# Altium schematic sheet ADC_Interface.SchDoc: ADC and DAC Signal Conditioning
size Tabloid; Organization: Davis Designs; Address1: Flycatcher Labs; SheetNumber: 5; SheetTotal: 6
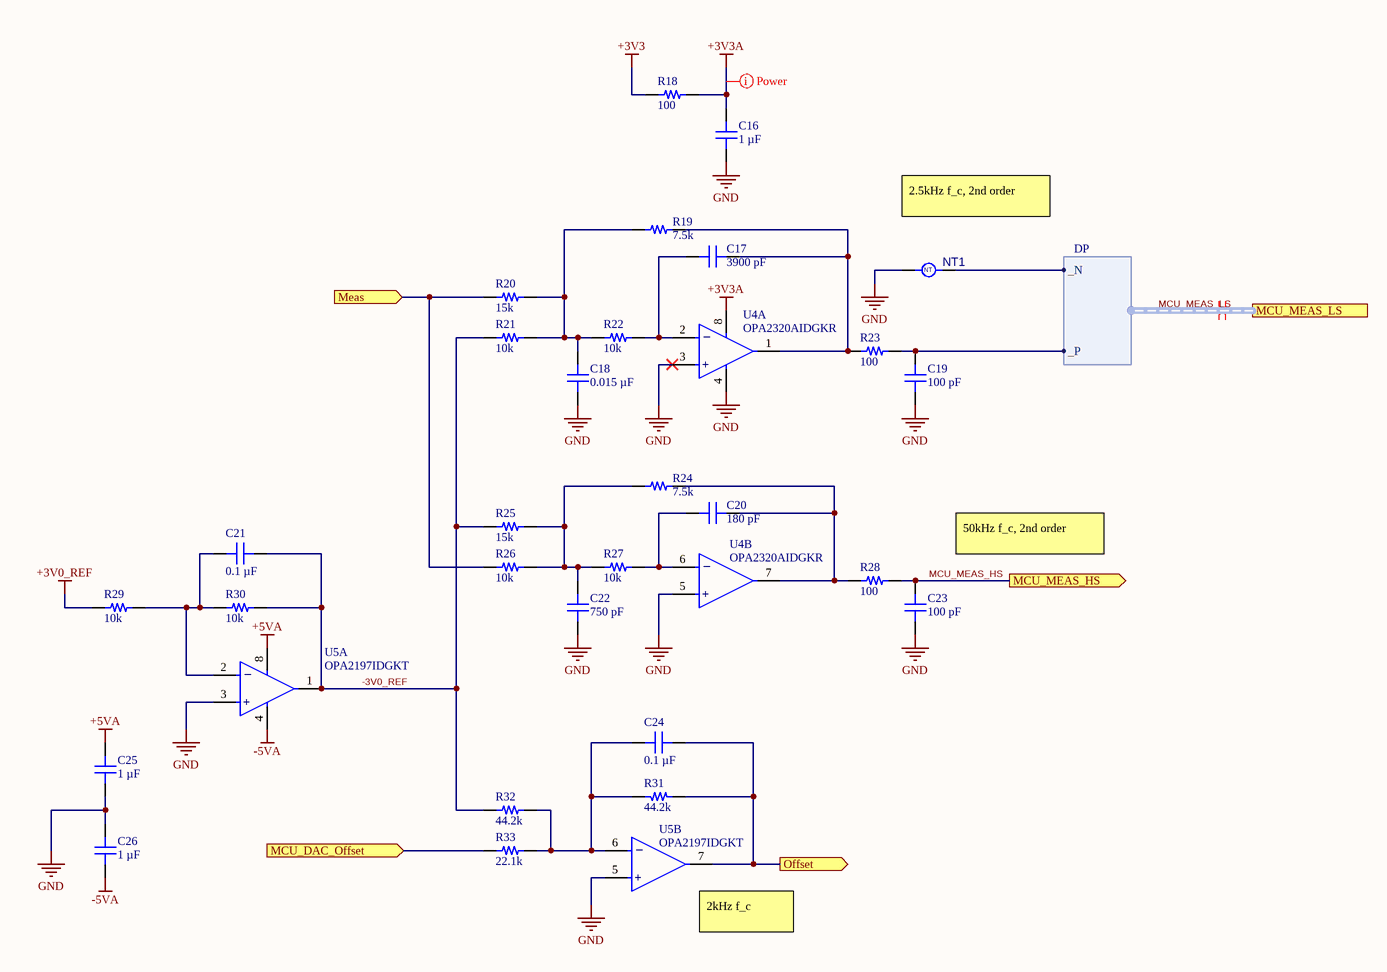
[diagram p0: ADC_Interface.SchDoc]

## Parts
C16  1 µF  [MURATA GRM155 0402_1005]
C17  3900 pF  [MURATA GRM155 0402_1005]
C18  0.015 µF  [MURATA GCM155 0402_1005]
C19  100 pF  [MURATA GCM155 0402_1005]
C20  180 pF  [MURATA GCM155 0402_1005]
C21  0.1 µF  [MURATA GRM155 0402_1005]
C22  750 pF  [MURATA GCM155 0402_1005]
C23  100 pF  [MURATA GCM155 0402_1005]
C24  0.1 µF  [MURATA GRM155 0402_1005]
C25  1 µF  [MURATA GRM155 0402_1005]
C26  1 µF  [MURATA GRM155 0402_1005]
NT1  Net Tie 10x8mil  [New footprint 1]  (value not drawn)  (net tie, no BOM)
R18  100  [RES 0402_1005]
R19  7.5k  [RES 0402_1005]
R20  15k  [RES 0402_1005]
R21  10k  [RES 0402_1005]
R22  10k  [RES 0402_1005]
R23  100  [RES 0402_1005]
R24  7.5k  [RES 0402_1005]
R25  15k  [RES 0402_1005]
R26  10k  [RES 0402_1005]
R27  10k  [RES 0402_1005]
R28  100  [RES 0402_1005]
R29  10k  [RES 0402_1005]
R30  10k  [RES 0402_1005]
R31  44.2k  [RES 0402_1005]
R32  44.2k  [RES 0402_1005]
R33  22.1k  [RES 0402_1005]
U4  OPA2320AIDGKR  [FP-DGK0008A-MFG]  (parts A,B of 2)
U5  OPA2197IDGKT  [FP-DGK0008A-MFG]  (parts A,B of 2)

## Ports
MCU_DAC_Offset (in), MCU_MEAS_HS (out), MCU_MEAS_LS (harness DP), Meas (in), Offset (out)

## Harnesses
DP: _N, _P

## Nets
+3V0_REF: R29.2
+3V3: R18.1
+3V3A: C16.2 R18.2 U4.8(V+)
+5VA: C25.2 U5.8(V+)
-5VA: C26.1 U5.4(V-)
GND: C16.1 C18.1 C19.1 C22.1 C23.1 C25.1 C26.2 NT1.1 U4.3(+INA) U4.4(V-) U4.5(+INB) U5.3(+INA) U5.5(+INB)
-3V0_REF: C21.1 R21.2 R25.1 R30.1 R32.1 U5.1(OUTA)
MCU_DAC_Offset: R33.1 ; port MCU_DAC_Offset
MCU_MEAS_HS: C23.2 R28.2 ; port MCU_MEAS_HS
MCU_MEAS_LS._N: NT1.2 ; port MCU_MEAS_LS._N
MCU_MEAS_LS._P: C19.2 R23.2 ; port MCU_MEAS_LS._P
Meas: R20.1 R26.2 ; port Meas
Offset: C24.1 R31.2 U5.7(OUTB) ; port Offset
NetC17_1: C17.1 R22.1 U4.2(-INA)
NetC17_2: C17.2 R19.2 R23.1 U4.1(OUTA)
NetC18_2: C18.2 R19.1 R20.2 R21.1 R22.2
NetC20_1: C20.1 R27.1 U4.6(-INB)
NetC20_2: C20.2 R24.2 R28.1 U4.7(OUTB)
NetC21_2: C21.2 R29.1 R30.2 U5.2(-INA)
NetC22_2: C22.2 R24.1 R25.2 R26.1 R27.2
NetC24_2: C24.2 R31.1 R32.2 R33.2 U5.6(-INB)

## Buses and harness runs
harness MCU_MEAS_LS = port MCU_MEAS_LS

## Layout directives
differential pair: (no net found under the mark)
net class Power: +3V3A

## Notes on the sheet
- 2.5kHz f_c, 2nd order
- 50kHz f_c, 2nd order
- (near U5) 2kHz f_c
- (in symbol CMP-009-00116-4) NT
- (in symbol CMP-014-00003-2, part A) –; +
- (in symbol CMP-014-00003-2, part B) –; +
- (in symbol CMP-014-00010-1, part A) –; +
- (in symbol CMP-014-00010-1, part B) –; +

## Library data of the parts
C16 C25 C26 = GRM155R61E105MA12D: CAP CER 1UF 25V X5R 0402; manufacturer: Murata Electronics; Tolerance: ±20%; Part Number: GRM155R61E105MA12D; Value: 1 µF; Applications: General Purpose; Capacitance: 1 µF; componentlink1description: Datasheet; componentlink1url: https://search.murata.co.jp/Ceramy/image/img/A01X/G101/ENG/GRM155R61E105MA12-01.pdf; componentlink2description: DigiKey Link; componentlink2url: https://www.digikey.com/en/products/detail/murata-electronics/GRM155R61E105MA12D/4905141; Device Package: 0402 (1005 Metric); lastupdated: 7/25/2024 4:50:24 AM; Lifecycle Status: Active; Minimum Order: 1; Mounting Type: Surface Mount, MLCC; Operating Temperature: -55°C ~ 85°C; Package / Case: 0402 (1005 Metric); packaging: TapeAndReel; partid: 3014; Part Status: Active; price: 0.01; series: GRM; Size / Dimension: 0.039" L x 0.020" W (1.00mm x 0.50mm); Supplier 1: DigiKey; Supplier Part Number 1: 490-10018-1-ND; Temperature Coefficient: X5R; Thickness (Max): 0.022" (0.55mm); Voltage - Rated: 25V
C17 = GRM1555C1H392GE01D: CAP CER 3900PF 50V C0G/NP0 0402; manufacturer: Murata Electronics; Temperature Coefficient: C0G, NP0; Tolerance: ±2%; Part Number: GRM1555C1H392GE01D; Value: 3900 pF; Applications: General Purpose; Capacitance: 3900 pF; componentlink1description: Datasheet; componentlink1url: https://search.murata.co.jp/Ceramy/image/img/A01X/G101/ENG/GRM1555C1H392GE01-01A.pdf; componentlink2description: DigiKey Link; componentlink2url: https://www.digikey.com/en/products/detail/murata-electronics/GRM1555C1H392GE01D/16033593; Device Package: 0402 (1005 Metric); lastupdated: 7/25/2024 4:50:21 AM; Lifecycle Status: Active; Minimum Order: 1; Mounting Type: Surface Mount, MLCC; Operating Temperature: -55°C ~ 125°C; Package / Case: 0402 (1005 Metric); packaging: TapeAndReel; partid: 41082; Part Status: Active; price: 0.01; series: GRM; Size / Dimension: 0.039" L x 0.020" W (1.00mm x 0.50mm); Supplier 1: DigiKey; Supplier Part Number 1: 490-GRM1555C1H392GE01DCT-ND; Thickness (Max): 0.022" (0.55mm); Voltage - Rated: 50V
C18 = GCM155R71H153KA55J: CAP CER 0.015UF 50V X7R 0402; manufacturer: Murata Electronics; Tolerance: ±10%; Part Number: GCM155R71H153KA55J; Value: 0.015 µF; Applications: Automotive; Capacitance: 0.015 µF; componentlink1description: Datasheet; componentlink1url: https://www.murata.com/-/media/webrenewal/support/library/catalog/products/k35e.ashx?la=en-us&cvid=20200508021757000000; componentlink2description: DigiKey Link; componentlink2url: https://www.digikey.com/en/products/detail/murata-electronics/GCM155R71H153KA55J/2591306; Device Package: 0402 (1005 Metric); lastupdated: 7/20/2024 2:04:16 AM; Lifecycle Status: Active; Minimum Order: 1; Mounting Type: Surface Mount, MLCC; Operating Temperature: -55°C ~ 125°C; Package / Case: 0402 (1005 Metric); packaging: TapeAndReel; partid: 49951; Part Status: Active; price: 0.01; Ratings: AEC-Q200; series: GCM; Size / Dimension: 0.039" L x 0.020" W (1.00mm x 0.50mm); Supplier 1: DigiKey; Supplier Part Number 1: 490-GCM155R71H153KA55JCT-ND; Temperature Coefficient: X7R; Thickness (Max): 0.022" (0.55mm); Voltage - Rated: 50V
C19 C23 = GCM1555C1H101FA16D: CAP CER 100PF 50V C0G/NP0 0402; manufacturer: Murata Electronics; Temperature Coefficient: C0G, NP0; Tolerance: ±1%; Part Number: GCM1555C1H101FA16D; Value: 100 pF; Applications: Automotive; Capacitance: 100 pF; componentlink1description: Datasheet; componentlink1url: https://search.murata.co.jp/Ceramy/image/img/A01X/G101/ENG/GCM1555C1H101FA16-01.pdf; componentlink2description: DigiKey Link; componentlink2url: https://www.digikey.com/en/products/detail/murata-electronics/GCM1555C1H101FA16D/6605978; Device Package: 0402 (1005 Metric); lastupdated: 7/20/2024 2:04:18 AM; Lifecycle Status: Active; Minimum Order: 1; Mounting Type: Surface Mount, MLCC; Operating Temperature: -55°C ~ 125°C; Package / Case: 0402 (1005 Metric); packaging: TapeAndReel; partid: 7484; Part Status: Active; price: 0.01; Ratings: AEC-Q200; series: GCM; Size / Dimension: 0.039" L x 0.020" W (1.00mm x 0.50mm); Supplier 1: DigiKey; Supplier Part Number 1: 490-14349-1-ND; Thickness (Max): 0.022" (0.55mm); Voltage - Rated: 50V
C20 = GCM1555C1H181JA16J: CAP CER 180PF 50V C0G/NP0 0402; manufacturer: Murata Electronics; Temperature Coefficient: C0G, NP0; Tolerance: ±5%; Part Number: GCM1555C1H181JA16J; Value: 180 pF; Applications: Automotive; Capacitance: 180 pF; componentlink1description: Datasheet; componentlink1url: https://www.murata.com/-/media/webrenewal/support/library/catalog/products/k35e.ashx?la=en-us&cvid=20200508021757000000; componentlink2description: DigiKey Link; componentlink2url: https://www.digikey.com/en/products/detail/murata-electronics/GCM1555C1H181JA16J/2590984; Device Package: 0402 (1005 Metric); lastupdated: 7/20/2024 2:04:15 AM; Lifecycle Status: Active; Minimum Order: 1; Mounting Type: Surface Mount, MLCC; Operating Temperature: -55°C ~ 125°C; Package / Case: 0402 (1005 Metric); packaging: TapeAndReel; partid: 55031; Part Status: Active; price: 0.01; Ratings: AEC-Q200; series: GCM; Size / Dimension: 0.039" L x 0.020" W (1.00mm x 0.50mm); Supplier 1: DigiKey; Supplier Part Number 1: 490-GCM1555C1H181JA16JCT-ND; Thickness (Max): 0.022" (0.55mm); Voltage - Rated: 50V
C21 C24 = GRM155R61H104KE19D: CAP CER 0.1UF 50V X5R 0402; manufacturer: Murata Electronics; Tolerance: ±10%; Part Number: GRM155R61H104KE19D; Value: 0.1 µF; Applications: General Purpose; Capacitance: 0.1 µF; componentlink1description: Datasheet; componentlink1url: https://search.murata.co.jp/Ceramy/image/img/A01X/G101/ENG/GRM155R61H104KE19-01.pdf; componentlink2description: DigiKey Link; componentlink2url: https://www.digikey.com/en/products/detail/murata-electronics/GRM155R61H104KE19D/5360887; Device Package: 0402 (1005 Metric); lastupdated: 7/25/2024 4:50:24 AM; Lifecycle Status: Active; Minimum Order: 1; Mounting Type: Surface Mount, MLCC; Operating Temperature: -55°C ~ 85°C; Package / Case: 0402 (1005 Metric); packaging: TapeAndReel; partid: 2975; Part Status: Active; price: 0.01; series: GRM; Size / Dimension: 0.039" L x 0.020" W (1.00mm x 0.50mm); Supplier 1: DigiKey; Supplier Part Number 1: 490-11917-1-ND; Temperature Coefficient: X5R; Thickness (Max): 0.022" (0.55mm); Voltage - Rated: 50V
C22 = GCM1555C1H751GA16D: CAP CER 750PF 50V C0G/NP0 0402; manufacturer: Murata Electronics; Temperature Coefficient: C0G, NP0; Tolerance: ±2%; Part Number: GCM1555C1H751GA16D; Value: 750 pF; Applications: Automotive; Capacitance: 750 pF; componentlink1description: Datasheet; componentlink1url: https://search.murata.co.jp/Ceramy/image/img/A01X/G101/ENG/GCM1555C1H751GA16-01.pdf; componentlink2description: DigiKey Link; componentlink2url: https://www.digikey.com/en/products/detail/murata-electronics/GCM1555C1H751GA16D/16033401; Device Package: 0402 (1005 Metric); lastupdated: 7/20/2024 2:04:15 AM; Lifecycle Status: Active; Minimum Order: 1; Mounting Type: Surface Mount, MLCC; Operating Temperature: -55°C ~ 125°C; Package / Case: 0402 (1005 Metric); packaging: TapeAndReel; partid: 55175; Part Status: Active; price: 0.01; Ratings: AEC-Q200; series: GCM; Size / Dimension: 0.039" L x 0.020" W (1.00mm x 0.50mm); Supplier 1: DigiKey; Supplier Part Number 1: 490-GCM1555C1H751GA16DCT-ND; Thickness (Max): 0.022" (0.55mm); Voltage - Rated: 50V
NT1 = CMP-009-00116-4: Pins: 2; Max Operating Temperature: 155°C; Min Operating Temperature: -55°C; ClassName: NetTie
R18 R23 R28 = CRCW0402100RFKEE: RES SMD 100 OHM 1% 1/16W 0402; Manufacturer: Vishay Dale; Value: 100 Ohms; Power (Watts): 0.063W, 1/16W; Temperature Coefficient: ±100ppm/°C; Part Number: CRCW0402100RFKEE; ComponentLink1Description: Datasheet; ComponentLink1URL: http://www.vishay.com/docs/20035/dcrcwe3.pdf; ComponentLink2Description: DigiKey Link; ComponentLink2URL: https://www.digikey.com/en/products/detail/vishay-dale/CRCW0402100RFKEE/5069886; Composition: Thick Film; Device Package: 0402 (1005 Metric); Features: Automotive AEC-Q200; Height - Seated (Max): 0.016" (0.40mm); LastUpdated: 2/9/2024 8:30:05 PM; Lifecycle Status: Active; Minimum Order: 1; Number of Terminations: 2; Operating Temperature: -55°C ~ 155°C; Package / Case: 0402 (1005 Metric); Packaging: CutTape; PartId: 6830; Part Status: Active; Price: 0.01; Ratings: AEC-Q200; Resistance: 100 Ohms; Series: CRCW; Size / Dimension: 0.039" L x 0.020" W (1.00mm x 0.50mm); Supplier 1: DigiKey; Supplier Part Number 1: 541-2953-1-ND; Supplier Device Package: 0402; Tolerance: ±1%
R19 R24 = ERA-2ARB752X: RES SMD 7.5K OHM 0.1% 1/16W 0402; Manufacturer: Panasonic Electronic Components; Value: 7.5 kOhms; Power (Watts): 0.063W, 1/16W; Temperature Coefficient: ±10ppm/°C; Part Number: ERA-2ARB752X; ComponentLink1Description: Datasheet; ComponentLink1URL: https://industrial.panasonic.com/cdbs/www-data/pdf/RDM0000/AOA0000C307.pdf; ComponentLink2Description: DigiKey Link; ComponentLink2URL: https://www.digikey.com/en/products/detail/panasonic-electronic-components/ERA-2ARB752X/5140927; Composition: Thin Film; Device Package: 0402 (1005 Metric); Features: Automotive AEC-Q200; Height - Seated (Max): 0.016" (0.40mm); LastUpdated: 2/9/2024 8:29:59 PM; Lifecycle Status: Active; Minimum Order: 1; Number of Terminations: 2; Operating Temperature: -55°C ~ 155°C; Package / Case: 0402 (1005 Metric); Packaging: TapeAndReel; PartId: 9056; Part Status: Active; Price: 0.21; Ratings: AEC-Q200; Resistance: 7.5 kOhms; Series: ERA-2A; Size / Dimension: 0.039" L x 0.020" W (1.00mm x 0.50mm); Supplier 1: DigiKey; Supplier Part Number 1: P7.5KCPCT-ND; Supplier Device Package: 0402; Tolerance: ±0.1%
R20 R25 = ERA-2AEB153X: RES SMD 15K OHM 0.1% 1/16W 0402; Manufacturer: Panasonic Electronic Components; Value: 15 kOhms; Power (Watts): 0.063W, 1/16W; Temperature Coefficient: ±25ppm/°C; Part Number: ERA-2AEB153X; ComponentLink1Description: Datasheet; ComponentLink1URL: https://industrial.panasonic.com/cdbs/www-data/pdf/RDM0000/AOA0000C307.pdf; ComponentLink2Description: DigiKey Link; ComponentLink2URL: https://www.digikey.com/en/products/detail/panasonic-electronic-components/ERA-2AEB153X/1706033; Composition: Thin Film; Device Package: 0402 (1005 Metric); Features: Automotive AEC-Q200; Height - Seated (Max): 0.016" (0.40mm); LastUpdated: 2/9/2024 8:30:08 PM; Lifecycle Status: Active; Minimum Order: 1; Number of Terminations: 2; Operating Temperature: -55°C ~ 155°C; Package / Case: 0402 (1005 Metric); Packaging: TapeAndReel; PartId: 6168; Part Status: Active; Price: 0.04; Ratings: AEC-Q200; Resistance: 15 kOhms; Series: ERA-2A; Size / Dimension: 0.039" L x 0.020" W (1.00mm x 0.50mm); Supplier 1: DigiKey; Supplier Part Number 1: P15KDCCT-ND; Supplier Device Package: 0402; Tolerance: ±0.1%
R21 R22 R26 R27 R29 R30 = ERA-2VRW1002X: RES 10K OHM 0.05% 1/10W 0402; Manufacturer: Panasonic Electronic Components; Value: 10 kOhms; Power (Watts): 0.1W, 1/10W; Temperature Coefficient: ±10ppm/°C; Part Number: ERA-2VRW1002X; ComponentLink1Description: Datasheet; ComponentLink1URL: https://api.pim.na.industrial.panasonic.com/file_stream/main/fileversion/9152; ComponentLink2Description: DigiKey Link; ComponentLink2URL: https://www.digikey.com/en/products/detail/panasonic-electronic-components/ERA-2VRW1002X/12085128; Composition: Thin Film; Device Package: 0402 (1005 Metric); Height - Seated (Max): 0.016" (0.40mm); LastUpdated: 2/9/2024 8:28:44 PM; Lifecycle Status: Active; Minimum Order: 1; Number of Terminations: 2; Operating Temperature: -55°C ~ 155°C; Package / Case: 0402 (1005 Metric); Packaging: TapeAndReel; PartId: 70282; Part Status: Active; Price: 0.21; Resistance: 10 kOhms; Series: ERA-2V; Size / Dimension: 0.039" L x 0.020" W (1.00mm x 0.50mm); Supplier 1: DigiKey; Supplier Part Number 1: 10-ERA-2VRW1002XCT-ND; Supplier Device Package: 0402; Tolerance: ±0.05%; Features: Anti-Sulfur, Automotive AEC-Q200; Ratings: AEC-Q200
R31 R32 = ERA-2ARB4422X: RES SMD 44.2KOHM 0.1% 1/16W 0402; Manufacturer: Panasonic Electronic Components; Value: 44.2 kOhms; Power (Watts): 0.063W, 1/16W; Temperature Coefficient: ±10ppm/°C; Part Number: ERA-2ARB4422X; ComponentLink1Description: Datasheet; ComponentLink1URL: https://industrial.panasonic.com/cdbs/www-data/pdf/RDM0000/AOA0000C307.pdf; ComponentLink2Description: DigiKey Link; ComponentLink2URL: https://www.digikey.com/en/products/detail/panasonic-electronic-components/ERA-2ARB4422X/5162316; Composition: Thin Film; Device Package: 0402 (1005 Metric); Features: Automotive AEC-Q200; Height - Seated (Max): 0.016" (0.40mm); LastUpdated: 2/9/2024 8:29:51 PM; Lifecycle Status: Active; Minimum Order: 1; Number of Terminations: 2; Operating Temperature: -55°C ~ 155°C; Package / Case: 0402 (1005 Metric); Packaging: TapeAndReel; PartId: 11805; Part Status: Active; Price: 0.21; Ratings: AEC-Q200; Resistance: 44.2 kOhms; Series: ERA-2A; Size / Dimension: 0.039" L x 0.020" W (1.00mm x 0.50mm); Supplier 1: DigiKey; Supplier Part Number 1: P18067CT-ND; Supplier Device Package: 0402; Tolerance: ±0.1%
R33 = ERA-2AEB2212X: RES SMD 22.1KOHM 0.1% 1/16W 0402; Manufacturer: Panasonic Electronic Components; Value: 22.1 kOhms; Power (Watts): 0.063W, 1/16W; Temperature Coefficient: ±25ppm/°C; Part Number: ERA-2AEB2212X; ComponentLink1Description: Datasheet; ComponentLink1URL: https://industrial.panasonic.com/cdbs/www-data/pdf/RDM0000/AOA0000C307.pdf; ComponentLink2Description: DigiKey Link; ComponentLink2URL: https://www.digikey.com/en/products/detail/panasonic-electronic-components/ERA-2AEB2212X/2026172; Composition: Thin Film; Device Package: 0402 (1005 Metric); Features: Automotive AEC-Q200; Height - Seated (Max): 0.016" (0.40mm); LastUpdated: 2/9/2024 8:29:56 PM; Lifecycle Status: Active; Minimum Order: 1; Number of Terminations: 2; Operating Temperature: -55°C ~ 155°C; Package / Case: 0402 (1005 Metric); Packaging: TapeAndReel; PartId: 9906; Part Status: Active; Price: 0.04; Ratings: AEC-Q200; Resistance: 22.1 kOhms; Series: ERA-2A; Size / Dimension: 0.039" L x 0.020" W (1.00mm x 0.50mm); Supplier 1: DigiKey; Supplier Part Number 1: P22.1KDCCT-ND; Supplier Device Package: 0402; Tolerance: ±0.1%
U4 = CMP-014-00010-1: Op Amp Dual Precision Amplifier R-R I/O ±2.75V/5.5V 8-Pin VSSOP T/R; Output Current per Channel: 65mA; Gain Bandwidth Product: 20MHz; Max Supply Voltage: 5.5V; Amplifier Type: GENERAL PURPOSE; Number of Channels: 2; Power Supply Rejection Ratio (PSRR): 106.02dB; Max I/O Voltage: 150uV; Min Dual Supply Voltage: 900mV; Slew Rate: 10V/µs; Supply Current: 1.45mA; Voltage Gain: 132dB; Max Dual Supply Voltage: 2.75V; Input Bias Current: 400pA; Min Supply Voltage: 1.8V; Common Mode Rejection Ratio: 100dB; Min Operating Temperature: -40°C; Radiation Hardening: No; Bandwidth: 20MHz; Output Current: 65mA; Case/Package: MSOP; Pins: 8; Packaging: Tape and Reel; Unity Gain Bandwidth Product: 20MHz; Package Quantity: 1; Technology: CMOS; Lead Free: Lead Free; Series: -; Input Offset Voltage (Vos): 150uV; Max Operating Temperature: 125°C; Reach SVHC Compliant: No; Number of Elements: 2; Number of Circuits: 2; RoHS Compliant: Yes; Number of Amplifiers: 2; Operating Supply Current: 1.45mA
U5 = CMP-014-00003-2: Dual 36-V, precision, rail-to-rail input output, low offset voltage op amp 8-VSSOP -40 to 125; Number of Circuits: 2; Input Bias Current: 5pA; Amplifier Type: GENERAL PURPOSE; Slew Rate: 20V/µs; Bandwidth: 10MHz; Input Offset Voltage (Vos): 250uV; Output Current per Channel: 65mA; Operating Supply Current: 1mA; Case/Package: VSSOP; Pins: 8; Reach SVHC Compliant: No; ComponentLink1Description: Datasheet; Number of Amplifiers: 2; RoHS Compliant: Yes; Min Operating Temperature: -40°C; Max Operating Temperature: 125°C; Number of Channels: 2; Packaging: Cut Tape; Gain Bandwidth Product: 10MHz; Lead Free: Lead Free; Series: -; ComponentLink1URL: https://www.ti.com/lit/ds/symlink/opa2197.pdf; Mounting Technology: Surface Mount